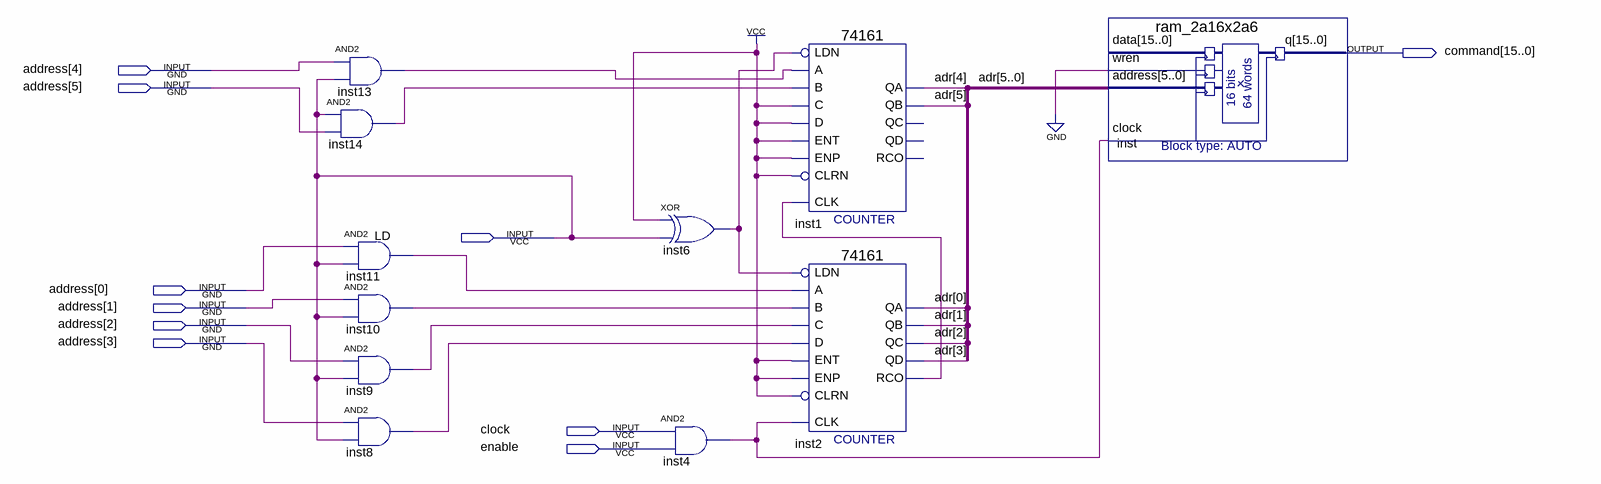
[diagram p0: schematic sheet]
// Quartus schematic controller.bdf as structural Verilog: 11 symbols, 10 pins
module controller (
  input  [5:0] address,
  input  LD,
  input  clock,
  input  enable,
  output [15:0] command
);

  wire inst2_rco, inst4_out, inst6_out, inst8_out, inst9_out, inst10_out, inst11_out, inst13_out, inst14_out;
  wire [5:0] adr;

  and inst13 (inst13_out, address[4], LD);
  and inst14 (inst14_out, LD, address[5]);
  and inst11 (inst11_out, address[0], LD);
  and inst10 (inst10_out, address[1], LD);
  and inst9 (inst9_out, address[2], LD);
  and inst8 (inst8_out, address[3], LD);
  xor inst6 (inst6_out, 1'b1, LD);
  and inst4 (inst4_out, clock, enable);
  \74161  inst1 (
    .CLRN(1'b1), .CLK(inst2_rco), .ENP(1'b1), .LDN(inst6_out), .A(inst13_out), .D(1'b1), .ENT(1'b1),
    .B(inst14_out), .C(1'b1), .QB(adr[5]), .QA(adr[4]));  // open: QD, QC, RCO
  \74161  inst2 (
    .CLRN(1'b1), .CLK(inst4_out), .ENP(1'b1), .LDN(inst6_out), .A(inst11_out), .D(inst8_out), .ENT(1'b1),
    .B(inst10_out), .C(inst9_out), .QD(adr[3]), .QC(adr[2]), .QB(adr[1]), .QA(adr[0]), .RCO(inst2_rco));
  ram_2a16x2a6 inst (.wren(1'b0), .address(adr), .clock(inst4_out), .q(command));  // open: data
endmodule
